# EAGLE design sensorShield (EAGLE 7.2.0)
CNAME: Final Year Project; CREVISION: 1.0; DESIGNER: Adil Benabdallah
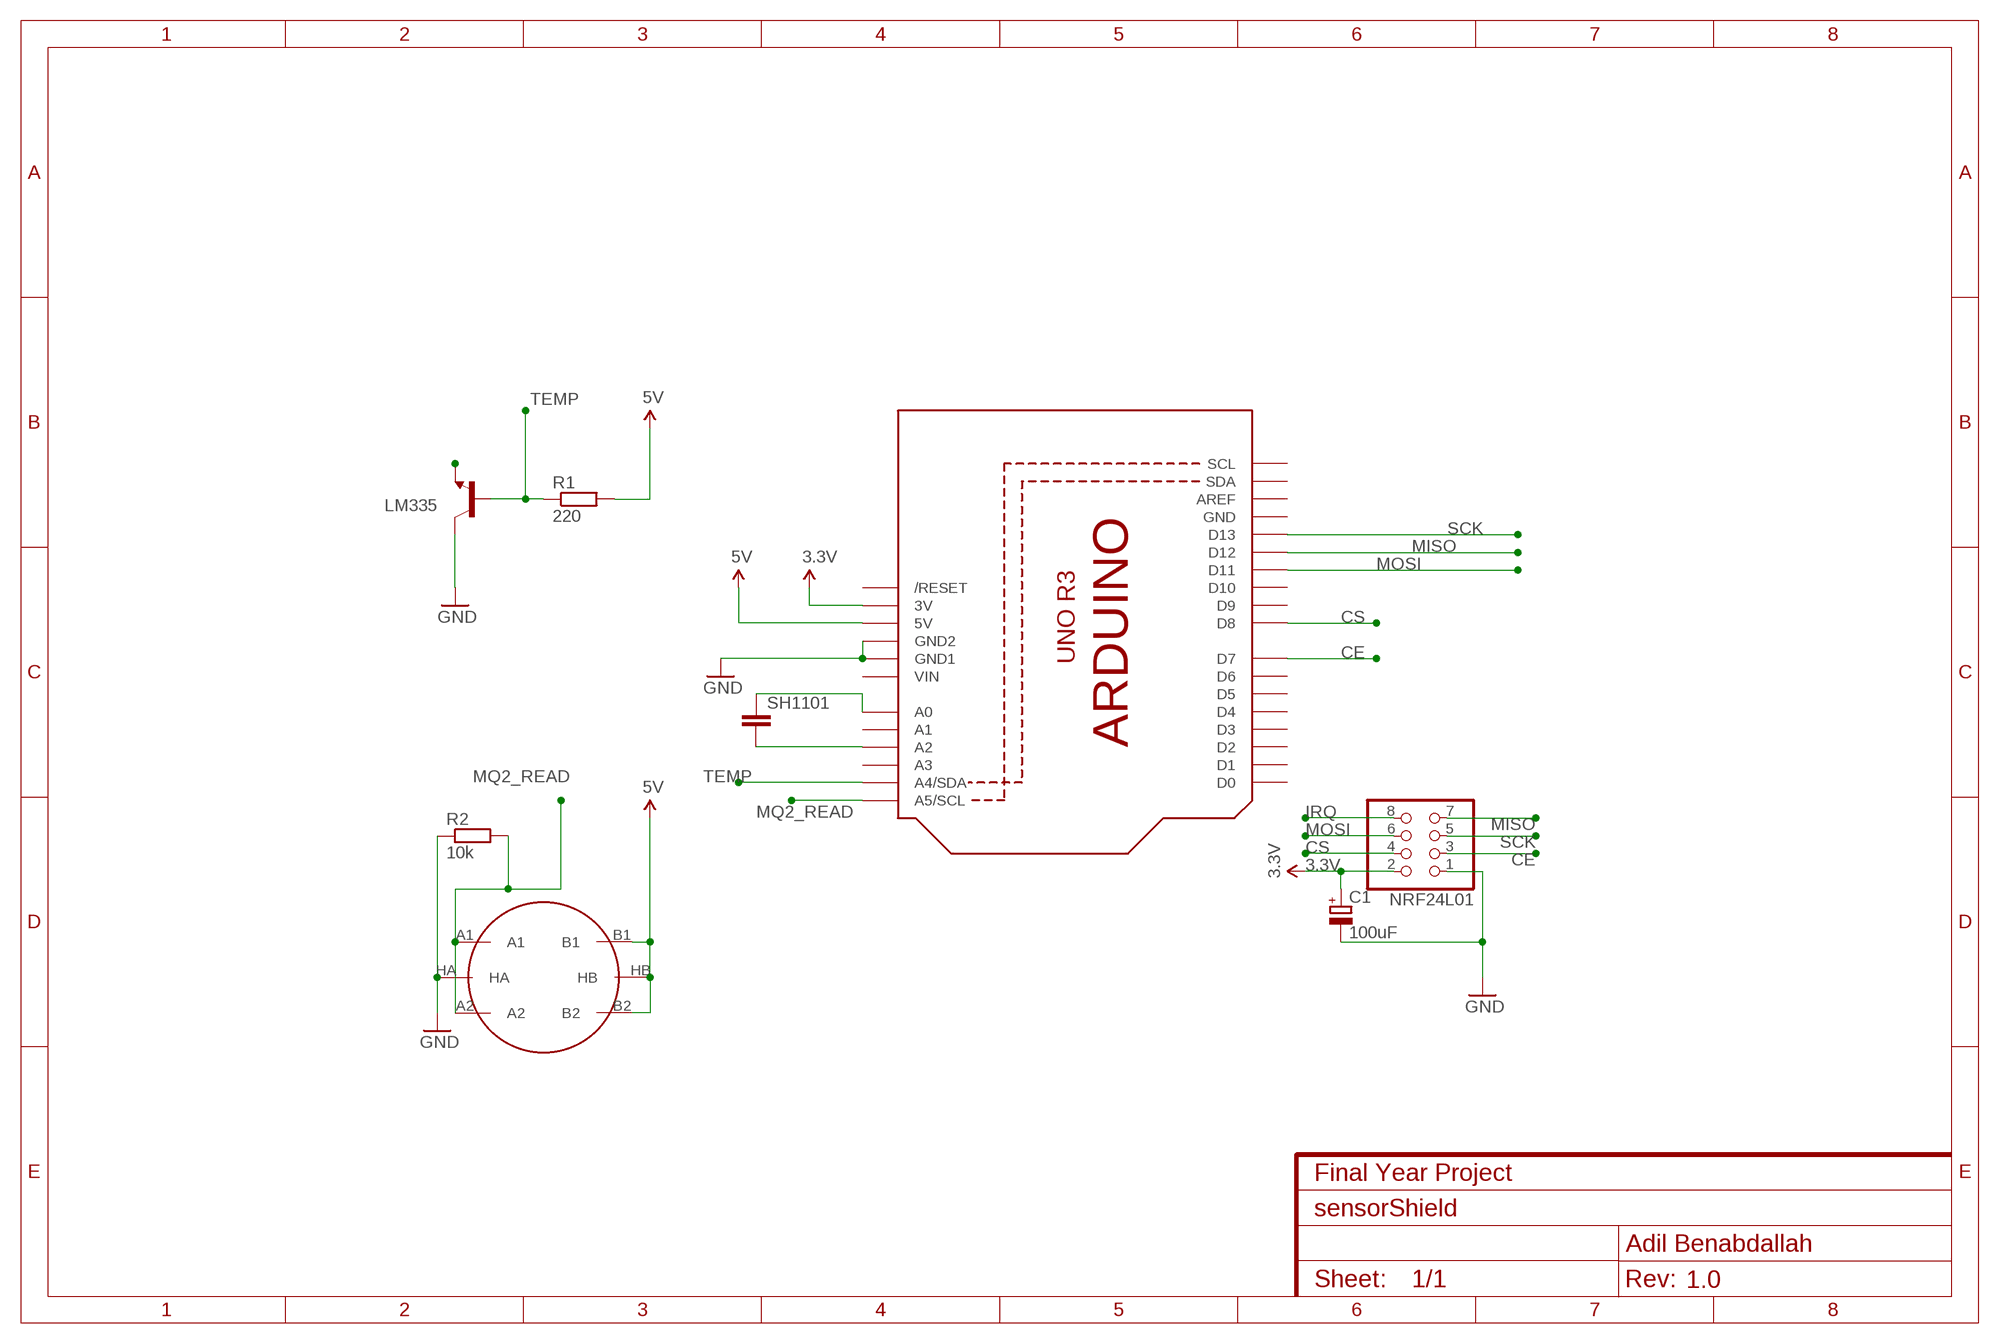
[diagram p0: schematic, sheet 1]

## Parts
C1  100uF  CPOL-EUE5-6  [E5-6]
LM335  TRANSISTOR_NPNTO-92-AMMO  [TO-92-AMMO]
NRF24L01  PINHD-2X4  [2X04]
Q1  ARDUINOR3-NOIOREF-NOTEXT  [ARDUINOR3-NOTEXT-NOIOREF]
R1  220  R-EU_0204/7  [0204/7]
R2  10k  R-EU_0204/7  [0204/7]
SH1101  C-EU050-024X044  [C050-024X044]
U$1  METHANE_SENSOR  [MQ-3]

## Nets
3.3V: C1.+ NRF24L01.2 Q1.3V
5V: Q1.5V R1.2 U$1.B1 U$1.B2 U$1.HB
CE: NRF24L01.3 Q1.D7
CS: NRF24L01.4 Q1.D8
GND: C1.- LM335.3(C) NRF24L01.1 Q1.GND1 Q1.GND2 R2.1 U$1.HA
IRQ: NRF24L01.8
MISO: NRF24L01.7 Q1.D12
MOSI: NRF24L01.6 Q1.D11
MQ2_READ: Q1.A5(A5/SCL) R2.2 U$1.A1 U$1.A2
N$2: LM335.1(E)
N$6: Q1.A2 SH1101.2
N$7: Q1.A0 SH1101.1
SCK: NRF24L01.5 Q1.D13
TEMP: LM335.2(B) Q1.A4(A4/SDA) R1.1
Unconnected: Q1.A1 Q1.A3 Q1.AREF Q1.D0 Q1.D1 Q1.D2 Q1.D3 Q1.D4 Q1.D5 Q1.D6 Q1.D9 Q1.D10 Q1.RESET(/RESET) Q1.SCL Q1.SDA

## Power pins joined to a net without a drawn wire
GND: Q1.GND
VIN: Q1.VIN

## Library data of the parts
C1 = rcl:CPOL-EU: POLARIZED CAPACITOR, European symbol
LM335 = SparkFun-DiscreteSemi:TRANSISTOR_NPN: Generic NPN BJT MMBT2222A - TRANS-08049 (SOT-23, 1A 40V) MPSA42 - TRANS-09116 (SOT-23, 500mA 300V) MMBT5088LT1G - TRANS-11160 (SOT-23, 50 mA 30V) BC547 - COM-08928 <http://www.sparkfun.com/products/8928> (TO-92 45V 100mA) (1.Collector 2.Base 3.Emitter) 2N3904 - COM-00521 <http://www.sparkfun.com/products/521> (TO-92 40V 200mA) (1.Emitter 2.Base 3.Collector) P2N2222A - COM-12852 <http://www.sparkfun.com/products/12852> (TO-92 40V 600mA) (1.Collector 2.Base 3.Emitter)
NRF24L01 = pinhead:PINHD-2X4: PIN HEADER
Q1 = adafruit:ARDUINOR3-NOIOREF
R1 R2 = rcl:R-EU_: RESISTOR, European symbol
SH1101 = rcl:C-EU: CAPACITOR, European symbol
U$1 = SparkFun-Sensors:METHANE_SENSOR: MQ-4 Methane Gas Sensor SEN-09404

## Board
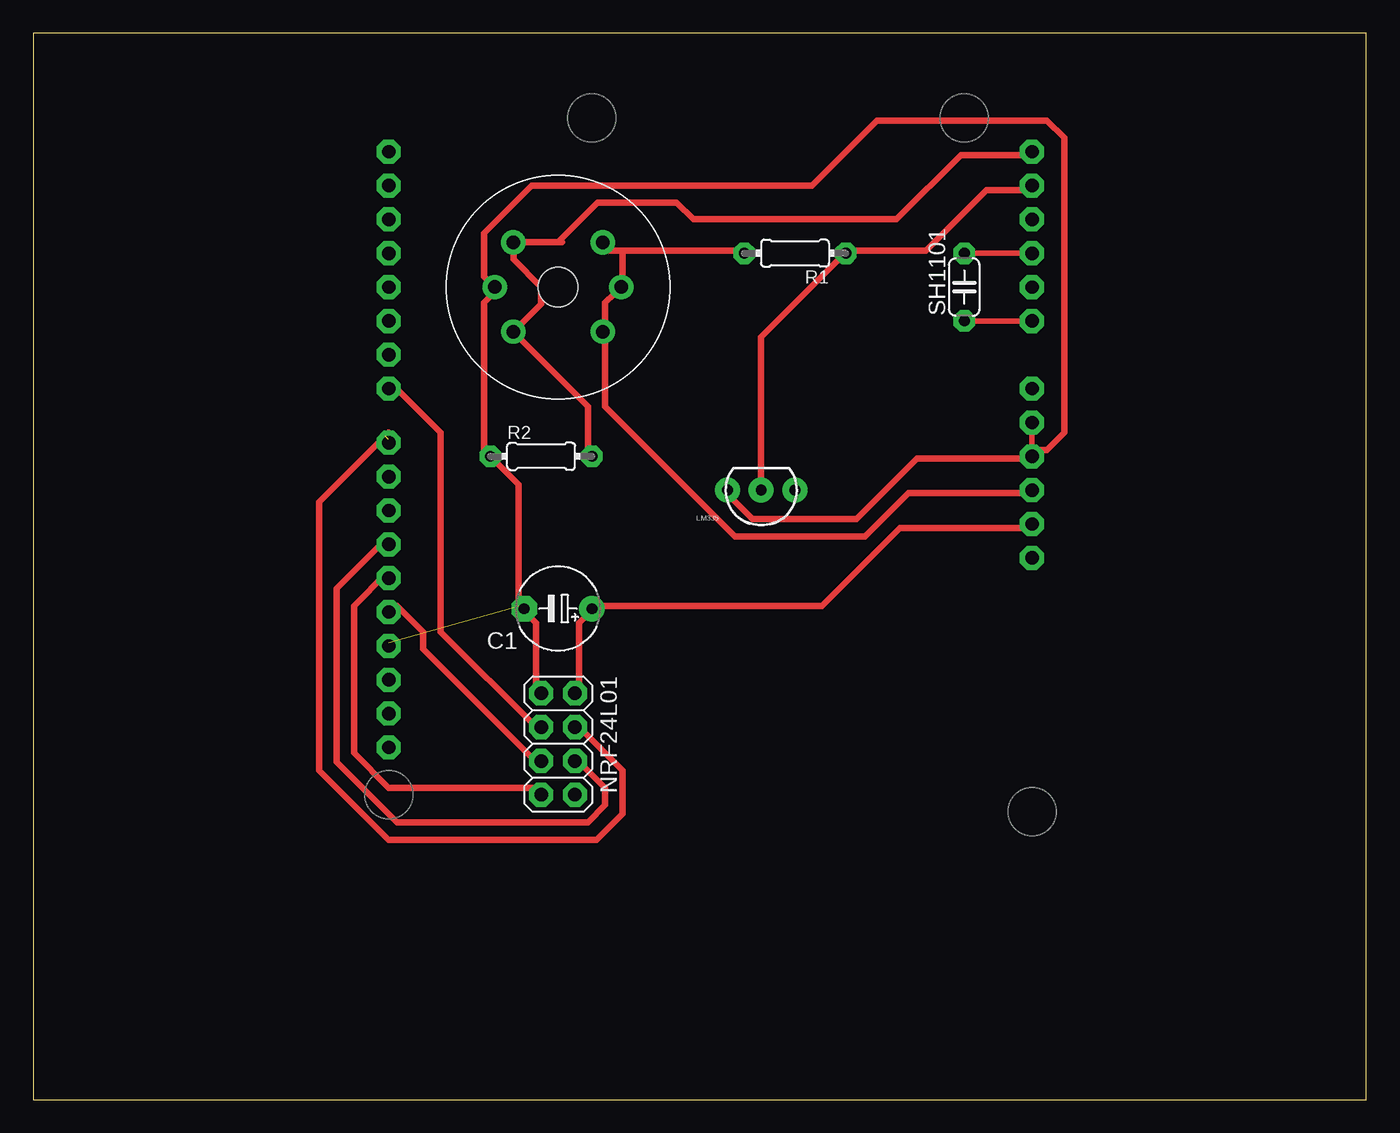
[diagram p1: board, top side]
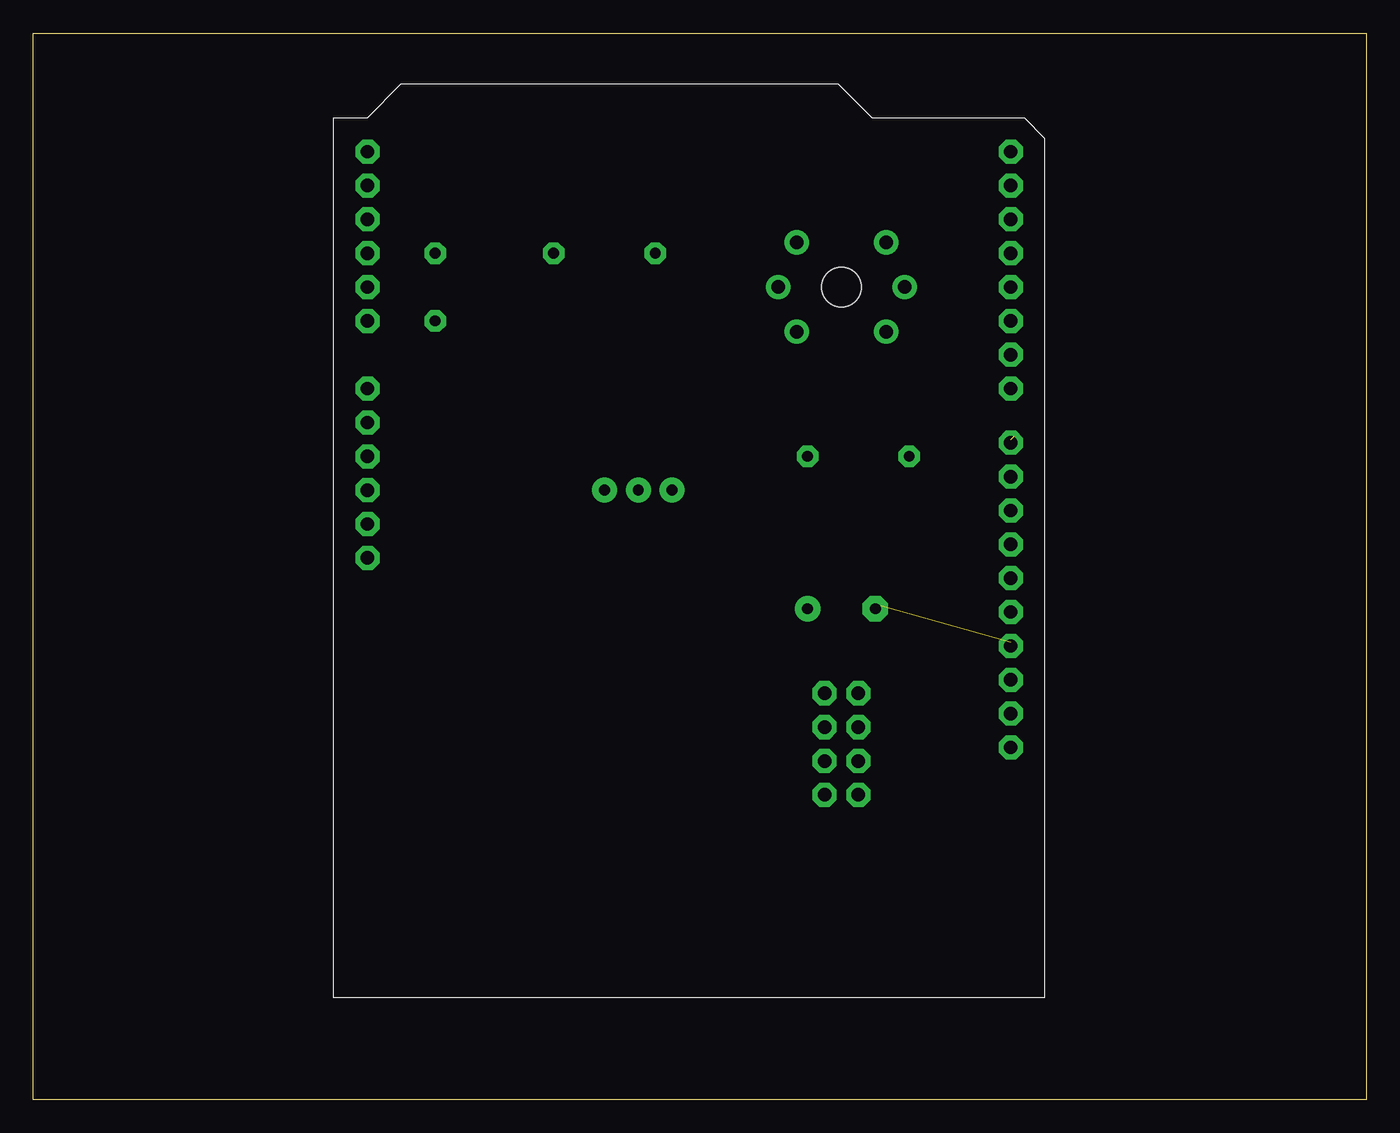
[diagram p2: board, bottom side, seen from below]

Size 100 x 80 mm. Coordinates in mm from the lower left corner, seen from the top.
Outline: 0,0 100,0 100,80 0,80 0,0
Copper layers (1*16): Top 0.035mm / dielectric 1.5mm / Bottom 0.035mm
Design rules "default *": minimum track width 0.5mm, minimum drill 24mil, track to track 0.8mm, track to pad 0.8mm, pad to pad 0.45mm, via to via 0.8mm, smd to smd 8mil, copper to edge 40mil, drill to drill 8mil, minimum pad ring 0.4mm, minimum via ring 0.4mm, stop-mask expansion 4mil, vias tented up to drill 0mil, thermal gap 10mil

### Footprints (pad centres in the part's own frame; a part is rotated, then mirrored left to right if it is on the bottom)
E5-6 = drill 0.813 pad 1.905: + -2.54,0 | drill 0.813 pad 1.905 octagon: - 2.54,0
TO-92-AMMO = drill 0.813 pad 1.88: 1 -2.54,0; 2 0,0; 3 2.54,0
2X04 = drill 1.016 octagon: 1 -3.81,-1.27; 2 -3.81,1.27; 3 -1.27,-1.27; 4 -1.27,1.27; 5 1.27,-1.27; 6 1.27,1.27; 7 3.81,-1.27; 8 3.81,1.27
ARDUINOR3-NOTEXT-NOIOREF = drill 1 pad 1.676 octagon: 3V 35.56,2.54; 5V 38.1,2.54; A0 50.8,2.54; A1 53.34,2.54; A2 55.88,2.54; A3 58.42,2.54; A4 60.96,2.54; A5 63.5,2.54; AREF 23.876,50.8; D0 63.5,50.8; D1 60.96,50.8; D2 58.42,50.8; D3 55.88,50.8; D4 53.34,50.8; D5 50.8,50.8; D6 48.26,50.8; D7 45.72,50.8; D8 41.656,50.8; D9 39.116,50.8; D10 36.576,50.8; D11 34.036,50.8; D12 31.496,50.8; D13 28.956,50.8; GND 26.416,50.8; GND1 43.18,2.54; GND2 40.64,2.54; RESET 33.02,2.54; SCL 18.796,50.8; SDA 21.336,50.8; VIN 45.72,2.54
0204/7 = drill 0.813 octagon: 1 -3.81,0; 2 3.81,0
C050-024X044 = drill 0.813 octagon: 1 -2.54,0; 2 2.54,0
MQ-3 = drill 1.016: A1 -3.35,3.35; A2 -3.35,-3.35; B1 3.35,3.35; B2 3.35,-3.35; HA -4.75,0; HB 4.75,0 | hole 3: 0,0

### Placement (x,y rotation side)
C1  39.37,36.83 180 top
LM335  54.61,45.72 180 top
NRF24L01  39.37,26.67 270 top
Q1  77.47,7.62 90 top
R1  57.15,63.5 180 top
R2  38.1,48.26 0 top
SH1101  69.85,60.96 90 top
U$1  39.37,60.96 0 top

### Tracks (layer width: path | path; a pad name or v marks a point on that pad's centre or on a via)
3.3V
  Top 0.406: Q1.3V 74.75,43.18 74.75,42.9
  Top 0.5: NRF24L01.2 40.95,30.55 40.95,35.75 41.6,36.4 C1.+ 42.25,37.05 59.15,37.05 65,42.9 74.75,42.9
5V
  Top 0.406: Q1.5V 74.75,45.72 74.75,45.5
  Top 0.5: 44.2,63.7 42.9,63.7 U$1.B1 | 44.2,63.7 53.3,63.7 R1.2 | 74.75,45.5 65.65,45.5 62.4,42.25 52.65,42.25 42.9,52 42.9,57.2 U$1.B2 42.9,57.85 42.9,59.8 43.55,60.45 U$1.HB 44.2,61.1 44.2,63.7
CE
  Top 0.406: Q1.D7 27.3,53.34 27.3,53.3
  Top 0.5: 27.3,53.3 30.55,50.05 30.55,35.1 37.7,27.95 NRF24L01.3
CS  (1 unrouted)
  Top 0.406: Q1.D8 26.67,49.53
  Top 0.5: 26.65,50.05 21.45,44.85 21.45,24.7 26.65,19.5 42.25,19.5 44.2,21.45 44.2,24.7 40.95,27.95 NRF24L01.4
GND  (1 unrouted)
  Top 0.406: Q1.GND 26.67,34.29 | 74.75,48.1 74.93,48.1 Q1.GND2 | Q1.GND2 Q1.GND1 | 75.4,48.75 74.93,48.75 Q1.GND2 | 36.4,37.05 36.83,37.05 C1.-
  Top 0.5: 74.75,48.1 66.3,48.1 61.75,43.55 53.95,43.55 52,45.5 LM335.3 | NRF24L01.1 37.7,30.55 37.7,35.75 37.05,36.4 C1.- 36.4,37.05 36.4,46.15 R2.1 33.8,48.75 33.8,59.8 34.45,60.45 U$1.HA 34.45,61.1 33.8,61.75 33.8,65 37.38,68.58 58.42,68.58 63.29,73.45 76.05,73.45 77.35,72.15 77.35,50.05 76.05,48.75 75.4,48.75
MISO
  Top 0.406: Q1.D12 26.52,39.12 26.52,39.52
  Top 0.5: 26.65,39.65 26.52,39.52 24.05,37.05 24.05,26 26.65,23.4 37.7,23.4 NRF24L01.7
MOSI
  Top 0.406: Q1.D11 26.49,41.66 26.49,42.09
  Top 0.5: 26.65,42.25 26.49,42.09 22.75,38.35 22.75,25.35 27.3,20.8 41.6,20.8 42.9,22.1 42.9,23.4 40.95,25.35 NRF24L01.6
MQ2_READ
  Top 0.406: Q1.A5 74.75,71.12 74.75,70.85
  Top 0.5: R2.2 41.6,48.75 41.6,52 36.4,57.2 U$1.A2 38.1,59.69 38.1,60.96 36.02,63.04 U$1.A1 36.4,64.35 39.37,64.35 | 39.65,64.35 39.37,64.35 | 74.75,70.85 69.58,70.85 64.77,66.04 49.53,66.04 48.26,67.31 42.33,67.31 39.37,64.35
N$6
  Top 0.406: SH1101.2 Q1.A2
N$7
  Top 0.406: SH1101.1 Q1.A0
SCK
  Top 0.406: Q1.D13 27.3,36.58 27.3,37.05
  Top 0.5: 27.3,37.05 29.25,35.1 29.25,33.8 37.7,25.35 NRF24L01.5
TEMP
  Top 0.406: Q1.A4 74.75,68.58 74.75,68.25
  Top 0.5: 74.75,68.25 71.5,68.25 66.95,63.7 61.1,63.7 R1.1 60.45,63.05 54.6,57.2 54.6,46.15 LM335.2